# Altium project z80uPC.PrjPCB
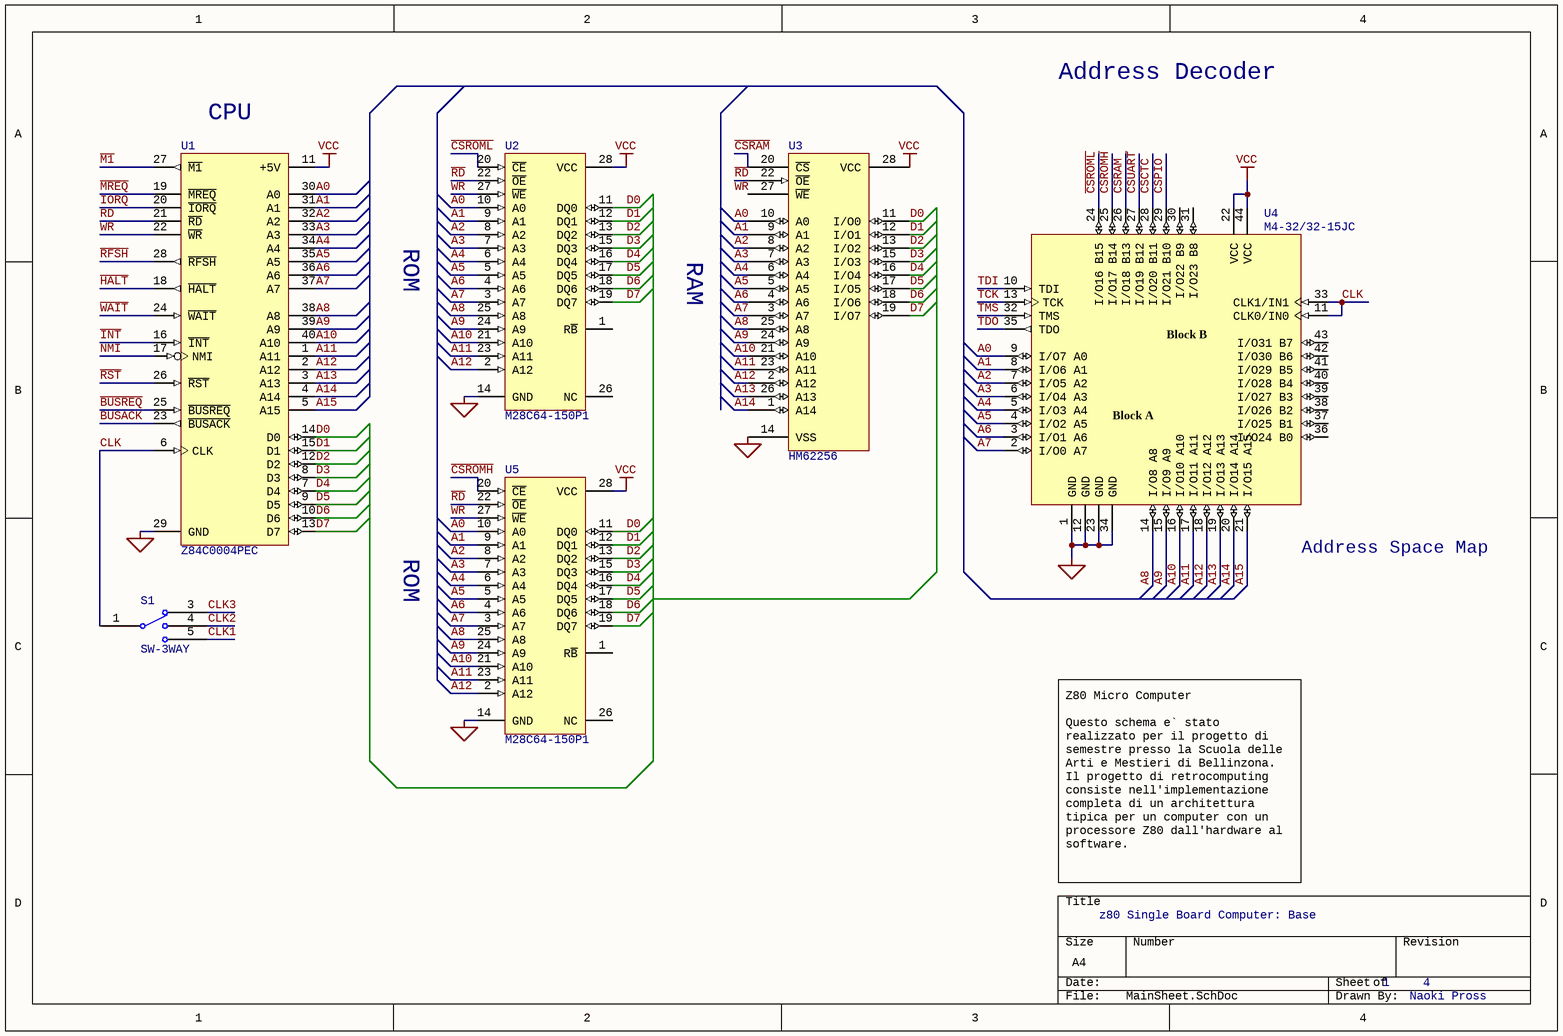
[diagram p0: MainSheet.SchDoc]
4 sheets, 72 parts. Net scope: global (net labels, ports and power ports of the same name join across sheets).
Sheets:
  MainSheet.SchDoc
  Peripherals.SchDoc
  IODevices.SchDoc
  BusViewer.SchDoc

## Sheet MainSheet.SchDoc: z80 Single Board Computer: Base
size A4; Author: Naoki Pross; DrawnBy: Naoki Pross; Organization: SAM Bellinzona; DocumentNumber: 1; Revision: 1; SheetNumber: 1; SheetTotal: 4; ProjectName: z80uPC

### Parts
S1  SW-3WAY
U1  Z84C0004PEC  [PDIP40]
U2  M28C64-150P1  [PDIP28]
U3  HM62256  [PDIP28]
U4  M4-32/32-15JC  [PLCC44_N]
U5  M28C64-150P1  [PDIP28]

### Nets
GND: U1.29(GND) U2.14(GND) U3.14(VSS) U4.1(GND) U4.12(GND) U4.23(GND) U4.34(GND) U5.14(GND)  [project net DB9-5]
VCC: U1.11(+5V) U2.28(VCC) U3.28(VCC) U4.22(VCC) U4.44(VCC) U5.28(VCC)
A0: U1.30(A0) U2.10(A0) U3.10(A0) U4.9(I/O7_A0) U5.10(A0)
A1: U1.31(A1) U2.9(A1) U3.9(A1) U4.8(I/O6_A1) U5.9(A1)
A2: U1.32(A2) U2.8(A2) U3.8(A2) U4.7(I/O5_A2) U5.8(A2)
A3: U1.33(A3) U2.7(A3) U3.7(A3) U4.6(I/O4_A3) U5.7(A3)
A4: U1.34(A4) U2.6(A4) U3.6(A4) U4.5(I/O3_A4) U5.6(A4)
A5: U1.35(A5) U2.5(A5) U3.5(A5) U4.4(I/O2_A5) U5.5(A5)
A6: U1.36(A6) U2.4(A6) U3.4(A6) U4.3(I/O1_A6) U5.4(A6)
A7: U1.37(A7) U2.3(A7) U3.3(A7) U4.2(I/O0_A7) U5.3(A7)
A8: U1.38(A8) U2.25(A8) U3.25(A8) U4.14(I/O8_A8) U5.25(A8)
A9: U1.39(A9) U2.24(A9) U3.24(A9) U4.15(I/O9_A9) U5.24(A9)
A10: U1.40(A10) U2.21(A10) U3.21(A10) U4.16(I/O10_A10) U5.21(A10)
A11: U1.1(A11) U2.23(A11) U3.23(A11) U4.17(I/O11_A11) U5.23(A11)
A12: U1.2(A12) U2.2(A12) U3.2(A12) U4.18(I/O12_A12) U5.2(A12)
A13: U1.3(A13) U3.26(A13) U4.19(I/O13_A13)
A14: U1.4(A14) U3.1(A14) U4.20(I/O14_A14)
A15: U1.5(A15) U4.21(I/O15_A15)
~{BUSACK}: U1.23(~{BUSACK})
~{BUSREQ}: U1.25(~{BUSREQ})
~{CSCTC}: U4.28(I/O20_B11)
~{CSPIO}: U4.29(I/O21_B10)
~{CSRAM}: U3.20(~{CS}) U4.26(I/O18_B13)
~{CSROMH}: U4.25(I/O17_B14) U5.20(~{CE})
~{CSROML}: U2.20(~{CE}) U4.24(I/O16_B15)
~{CSUART}: U4.27(I/O19_B12)
CLK: U1.6(CLK) U4.11(CLK0/IN0) U4.33(CLK1/IN1)
D0: U1.14(D0) U2.11(DQ0) U3.11(I/O0) U5.11(DQ0)
D1: U1.15(D1) U2.12(DQ1) U3.12(I/O1) U5.12(DQ1)
D2: U1.12(D2) U2.13(DQ2) U3.13(I/O2) U5.13(DQ2)
D3: U1.8(D3) U2.15(DQ3) U3.15(I/O3) U5.15(DQ3)
D4: U1.7(D4) U2.16(DQ4) U3.16(I/O4) U5.16(DQ4)
D5: U1.9(D5) U2.17(DQ5) U3.17(I/O5) U5.17(DQ5)
D6: U1.10(D6) U2.18(DQ6) U3.18(I/O6) U5.18(DQ6)
D7: U1.13(D7) U2.19(DQ7) U3.19(I/O7) U5.19(DQ7)
~{HALT}: U1.18(~{HALT})
~{INT}: U1.16(~{INT})
~{IORQ}: U1.20(~{IORQ})
~{M1}: U1.27(~{M1})
~{MREQ}: U1.19(~{MREQ})
NMI: U1.17(NMI)
~{RD}: U1.21(~{RD}) U2.22(~{OE}) U3.22(~{OE}) U5.22(~{OE})
~{RFSH}: U1.28(~{RFSH})
~{RST}: U1.26(~{RST})
TCK: U4.13(TCK)
TDI: U4.10(TDI)
TDO: U4.35(TDO)
TMS: U4.32(TMS)
~{WAIT}: U1.24(~{WAIT})
~{WR}: U1.22(~{WR}) U2.27(~{WE}) U5.27(~{WE})

Not connected (* = marked no-connect by the designer): S1 1 3 4 5; U2 1(R~{B}) 26(NC); U3 27(~{WE}); U4 30(I/O22_B9) 31(I/O23_B8) 36(I/O24_B0) 37(I/O25_B1) 38(I/O26_B2) 39(I/O27_B3) 40(I/O28_B4) 41(I/O29_B5) 42(I/O30_B6) 43(I/O31_B7); U5 1(R~{B}) 26(NC)

### Notes on the sheet
- Address Decoder
- (near U1) CPU
- ROM
- RAM
- (near U4) Address Space Map
- Z80 Micro Computer
  Questo schema e` stato realizzato per il progetto di semestre presso la Scuola delle Arti e Mestieri di Bellinzona. Il progetto di retrocomputing consiste nell'implementazione completa di un architettura tipica per un computer con un processore Z80 dall'hardware al software.
- Labels drawn without touching a wire or pin: ~{WR}
- (in symbol M4-32/32-15JC) Block B; Block A

### Library data of the parts
S1 = SW-3WAY: SGA-13P-03V-7295
U1 = Z84C0004PEC: CMOS 8-Bit Microprocessor; Published: 15-Apr-2002; LatestRevisionDate: 04-Mar-2005; LatestRevisionNote: Stylized 3D Model Added.; DatasheetVersion: Jan-1989; PackageVersion: Jun-1999; PackageReference: PDIP40; Publisher: Altium Limited; PackageDescription: DIP; 40 Leads; Row Spacing 15.24 mm; Pitch 2.54 mm; ComponentLink1Description: Manufacturer Link; ComponentLink1URL: http://www.zilog.com/
U2 U5 = M28C64-150P1: Parallel 64 Kbit (8K x 8) EEPROM with Software Data Protection; Published: 24-Aug-2001; LatestRevisionDate: 06-Jun-2005; LatestRevisionNote: Stylized 3D Model Added.; DatasheetVersion: Jun-1996; PackageVersion: Jan-2003; PackageReference: PDIP28; Publisher: Altium Limited; PackageDescription: DIP; 28 Leads; Row Spacing 15.24 mm; Pitch 2.54 mm; ComponentLink1Description: Manufacturer Link; ComponentLink1URL: http://www.st.com/
U3 = HM62256: 8K x 8 Static RAM
U4 = M4-32/32-15JC: High-Performance EE CMOS In-System Programmable Logic; Published: 23-Sep-2002; LatestRevisionDate: 13-Apr-2006; LatestRevisionNote: IPC-7351 Footprint Added.; DatasheetVersion: Mar-2000; PackageVersion: pkg_32, Aug-2005; PackageReference: PLCC44; Publisher: Altium Limited; PackageDescription: 44-Pin Leaded Chip Carrier 1.27 mm Pitch; Code_IPC: PLCC-44; ComponentLink1Description: Manufacturer Link; ComponentLink1URL: http://www.latticesemi.com/products/mature/index.cfm; ComponentLink2Description: Datasheet; ComponentLink2URL: http://www.latticesemi.com/lit/docs/datasheets/cpld/mach4.pdf

## Sheet Peripherals.SchDoc: z80 Single Board Computer: Peripherals
size A4; DrawnBy: Naoki Pross; SheetNumber: 2; SheetTotal: 4
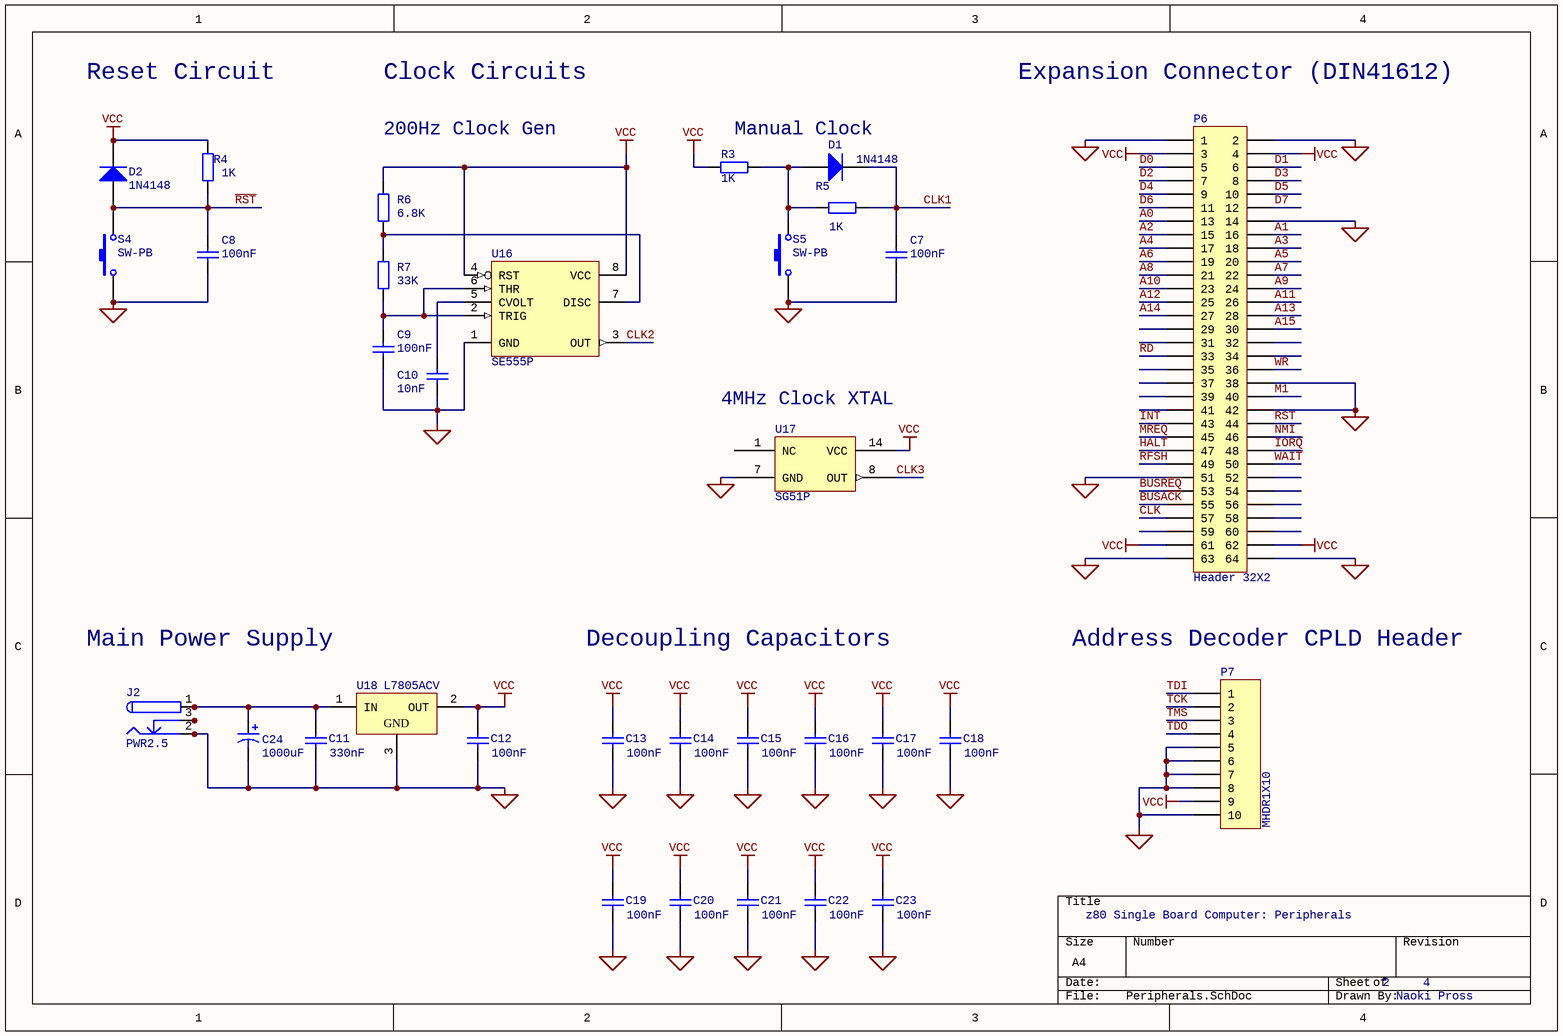
[diagram p1: Peripherals.SchDoc]

### Parts
C7  value 100nF  [RAD-0.1]  (hidden comment: Cap)
C8  value 100nF  [RAD-0.1]  (hidden comment: Cap)
C9  value 100nF  [RAD-0.1]  (hidden comment: Cap)
C10  value 10nF  [RAD-0.4]  (hidden comment: Cap)
C11  value 330nF  [RAD-0.3]  (hidden comment: Cap)
C12  value 100nF  [RAD-0.1]  (hidden comment: Cap)
C13  value 100nF  [RAD-0.1]  (hidden comment: Cap)
C14  value 100nF  [RAD-0.1]  (hidden comment: Cap)
C15  value 100nF  [RAD-0.1]  (hidden comment: Cap)
C16  value 100nF  [RAD-0.1]  (hidden comment: Cap)
C17  value 100nF  [RAD-0.1]  (hidden comment: Cap)
C18  value 100nF  [RAD-0.1]  (hidden comment: Cap)
C19  value 100nF  [RAD-0.1]  (hidden comment: Cap)
C20  value 100nF  [RAD-0.1]  (hidden comment: Cap)
C21  value 100nF  [RAD-0.1]  (hidden comment: Cap)
C22  value 100nF  [RAD-0.1]  (hidden comment: Cap)
C23  value 100nF  [RAD-0.1]  (hidden comment: Cap)
C24  value 1000uF  [RB5-10.5]  (hidden comment: Cap Pol1)
D1  1N4148  [DO-35]
D2  1N4148  [DO-35]
J2  PWR2.5  [KLD-0202]
P6  Header 32X2  [0973264X804]
P7  MHDR1X10  [HDR5x2_SOCK]
R3  value 1K  [AXIAL-0.4]  (hidden comment: Res2)
R4  value 1K  [AXIAL-0.4]  (hidden comment: Res2)
R5  value 1K  [AXIAL-0.4]  (hidden comment: Res2)
R6  value 6.8K  [AXIAL-0.4]  (hidden comment: Res2)
R7  value 33K  [AXIAL-0.4]  (hidden comment: Res2)
S4  SW-PB  [DPST-4]
S5  SW-PB  [DPST-4]
U16  SE555P  [P008]
U17  SG51P  [DIP14]
U18  L7805ACV  [TO220ABN]

### Nets
GND: C7.1 C8.1 C9.1 C10.1 C11.1 C12.1 C13.1 C14.1 C15.1 C16.1 C17.1 C18.1 C19.1 C20.1 C21.1 C22.1 C23.1 C24.2 J2.2 J2.2A J2.2B P6.1 P6.2 P6.14 P6.38 P6.42 P6.51 P6.63 P6.64 P7.5 P7.6 P7.7 P7.8 P7.10 S4.1 S5.1 U16.1(GND) U17.7(GND) U18.3(GND)  [project net DB9-5]
VCC: C12.2 C13.2 C14.2 C15.2 C16.2 C17.2 C18.2 C19.2 C20.2 C21.2 C22.2 C23.2 D2.2(K) P6.3 P6.4 P6.61 P6.62 P7.9 R3.2 R4.2 R6.2 U16.4(RST) U16.8(VCC) U17.14(VCC) U18.2(OUT)
A0: P6.13
A1: P6.16
A2: P6.15
A3: P6.18
A4: P6.17
A5: P6.20
A6: P6.19
A7: P6.22
A8: P6.21
A9: P6.24
A10: P6.23
A11: P6.26
A12: P6.25
A13: P6.28
A14: P6.27
A15: P6.30
~{BUSACK}: P6.55
~{BUSREQ}: P6.53
CLK: P6.57
CLK1: C7.2 D1.2(K) R5.2
CLK2: U16.3(OUT)
CLK3: U17.8(OUT)
D0: P6.5
D1: P6.6
D2: P6.7
D3: P6.8
D4: P6.9
D5: P6.10
D6: P6.11
D7: P6.12
~{HALT}: P6.47
~{INT}: P6.43
~{IORQ}: P6.48
~{M1}: P6.40
~{MREQ}: P6.45
NMI: P6.46
~{RD}: P6.33
~{RFSH}: P6.49
~{RST}: C8.2 D2.1(A) P6.44 R4.1 S4.2
TCK: P7.2
TDI: P7.1
TDO: P7.4
TMS: P7.3
~{WAIT}: P6.50
~{WR}: P6.36
NetC9_2: C9.2 R7.1 U16.2(TRIG) U16.6(THR)
NetC10_2: C10.2 U16.5(CVOLT)
NetC11_2: C11.2 C24.1 J2.1 J2.1A J2.1B U18.1(IN)
NetD1_1: D1.1(A) R3.1 R5.1 S5.2
NetJ2_3: J2.3 J2.3A J2.3B
NetR6_1: R6.1 R7.2 U16.7(DISC)

Not connected (* = marked no-connect by the designer): P6 29 31 32 34 35 37 39 41 52 54 56 58 59 60; U17 1(NC)

### Notes on the sheet
- Reset Circuit
- Clock Circuits
- Expansion Connector (DIN41612)
- 200Hz Clock Gen
- Manual Clock
- (near U17) 4MHz Clock XTAL
- Main Power Supply
- Decoupling Capacitors
- (near P7) Address Decoder CPLD Header

### Library data of the parts
C7-C23 = Cap: Capacitor; Published: 8-Jun-2000; LatestRevisionDate: 17-Jul-2002; LatestRevisionNote: Re-released for DXP Platform.; PackageReference: RAD-0.3; Publisher: Altium Limited; PackageDescription: Radial Cap, Thru-Hole; 2 Leads; 0.3 in Pin Spacing
C24 = Cap Pol1: Polarized Capacitor (Radial); Published: 8-Jun-2000; LatestRevisionDate: 17-Jul-2002; LatestRevisionNote: Re-released for DXP Platform.; PackageReference: RB7.6-15; Publisher: Altium Limited; PackageDescription: Polarized Capacitor (Radial); 2 Leads
D1 D2 = Diode 1N4148: High Conductance Fast Diode; Published: 8-Jun-2000; LatestRevisionDate: 17-Jul-2002; LatestRevisionNote: Re-released for DXP Platform.; DatasheetVersion: 1997; PackageReference: DO-35; Publisher: Altium Limited; PackageDescription: Diode, Axial; Body 3.8 x 1.9 mm (LxDia. max), Lead Dia. 0.53 mm (max); Code_JEDEC: DO-204-AH; ComponentLink1Description: Manufacturer Link; ComponentLink1URL: http://www.fairchildsemi.com/; ComponentLink2Description: Datasheet; ComponentLink2URL: http://www.fairchildsemi.com/ds/1N%2F1N4148.pdf
J2 = PWR2.5: Low Voltage Power Supply Connector; pin to pad: 1A>1 1B>1 2A>2 2B>2 3A>3 3B>3; Published: 17-Dec-2003; DatasheetDocument: 09-May-2002; Publisher: Altium Limited; ComponentLink1Description: Manufacturer Link; ComponentLink1URL: http://domino.kycon.com/internet/Products.html
P6 = Header 32X2: Header, 32-Pin, Dual row; pin to pad: 1>C1 2>A1 3>C2 4>A2 5>C3 6>A3 7>C4 8>A4 9>C5 10>A5 11>C6 12>A6 13>C7 14>A7 15>C8 16>A8 17>C9 18>A9 19>C10 20>A10 21>C11 22>A11 23>C12 24>A12 25>C13 26>A13 27>C14 28>A14 29>C15 30>A15 31>C16 32>A16 33>C17 34>A17 35>C18 36>A18 37>C19 38>A19 39>C20 40>A20 41>C21 42>A21 43>C22 44>A22 45>C23 46>A23 47>C24 48>A24 49>C25 50>A25 51>C26 52>A26 53>C27 54>A27 55>C28 56>A28 57>C29 58>A29 59>C30 60>A30 61>C31 62>A31 63>C32 64>A32; LatestRevisionDate: 17-Jul-2002; LatestRevisionNote: Re-released for DXP Platform.; Publisher: Altium Limited
P7 = MHDR1X10: Header, 10-Pin; LatestRevisionDate: 17-Jul-2002; LatestRevisionNote: Re-released for DXP Platform.; Publisher: Altium Limited
R3-R7 = Res2: Resistor; Published: 8-Jun-2000; LatestRevisionDate: 17-Jul-2002; LatestRevisionNote: Re-released for DXP Platform.; PackageReference: AXIAL-0.4; Publisher: Altium Limited; PackageDescription: Axial Device, Thru-Hole; 2 Leads; 0.4 in Pin Spacing
S4 S5 = SW-PB: Switch; Published: 24-Mar-1999; LatestRevisionDate: 17-Jul-2002; LatestRevisionNote: Re-released for DXP Platform.; PackageReference: SPST-2; Publisher: Altium Limited; PackageDescription: Switch; 2 Leads
U16 = SE555P: Precision Timer; Published: 16-Jan-2001; LatestRevisionDate: 04-Mar-2005; LatestRevisionNote: Stylized 3D Model Added.; DatasheetVersion: Feb-1992; PackageVersion: Jun-1999; PackageReference: P008; Publisher: Altium Limited; PackageDescription: DIP; 8 Leads; Row Spacing 7.62 mm; Pitch 2.54 mm; Code_JEDEC: MO-001-AN; ComponentLink1Description: Manufacturer Link; ComponentLink1URL: http://www.ti.com/; ComponentLink2Description: Datasheet; ComponentLink2URL: http://www-s.ti.com/sc/ds/se555.pdf
U17 = SG51P: 4.000000  MHz High Frequency Oscillator
U18 = L7805ACV: Precision 1A Regulator; Note: Tab is connected to pin 3 (GND).; Published: 24-Aug-2001; LatestRevisionDate: 17-Jul-2002; LatestRevisionNote: Re-released for DXP Platform.; DatasheetVersion: Nov-1999; PackageVersion: Jun-1998; PackageReference: TO220ABN; Publisher: Altium Limited; PackageDescription: TO, Thru-Hole, Vertical, Heatsink Mounted; 3 In-Line Leads; Pitch 2.54 mm; Pin sequence 1, 3, 2; ComponentLink1Description: Manufacturer Link; ComponentLink1URL: http://www.st.com/; ComponentLink2Description: Datasheet; ComponentLink2URL: http://www.st.com/stonline/products/literature/ds/2144/l7805ab.pdf

## Sheet IODevices.SchDoc: z80 Single Board Computer: I/O Devices
size A4; Author: Naoki Pross; DrawnBy: Naoki Pross; DocumentNumber: 3; SheetNumber: 2; SheetTotal: 4
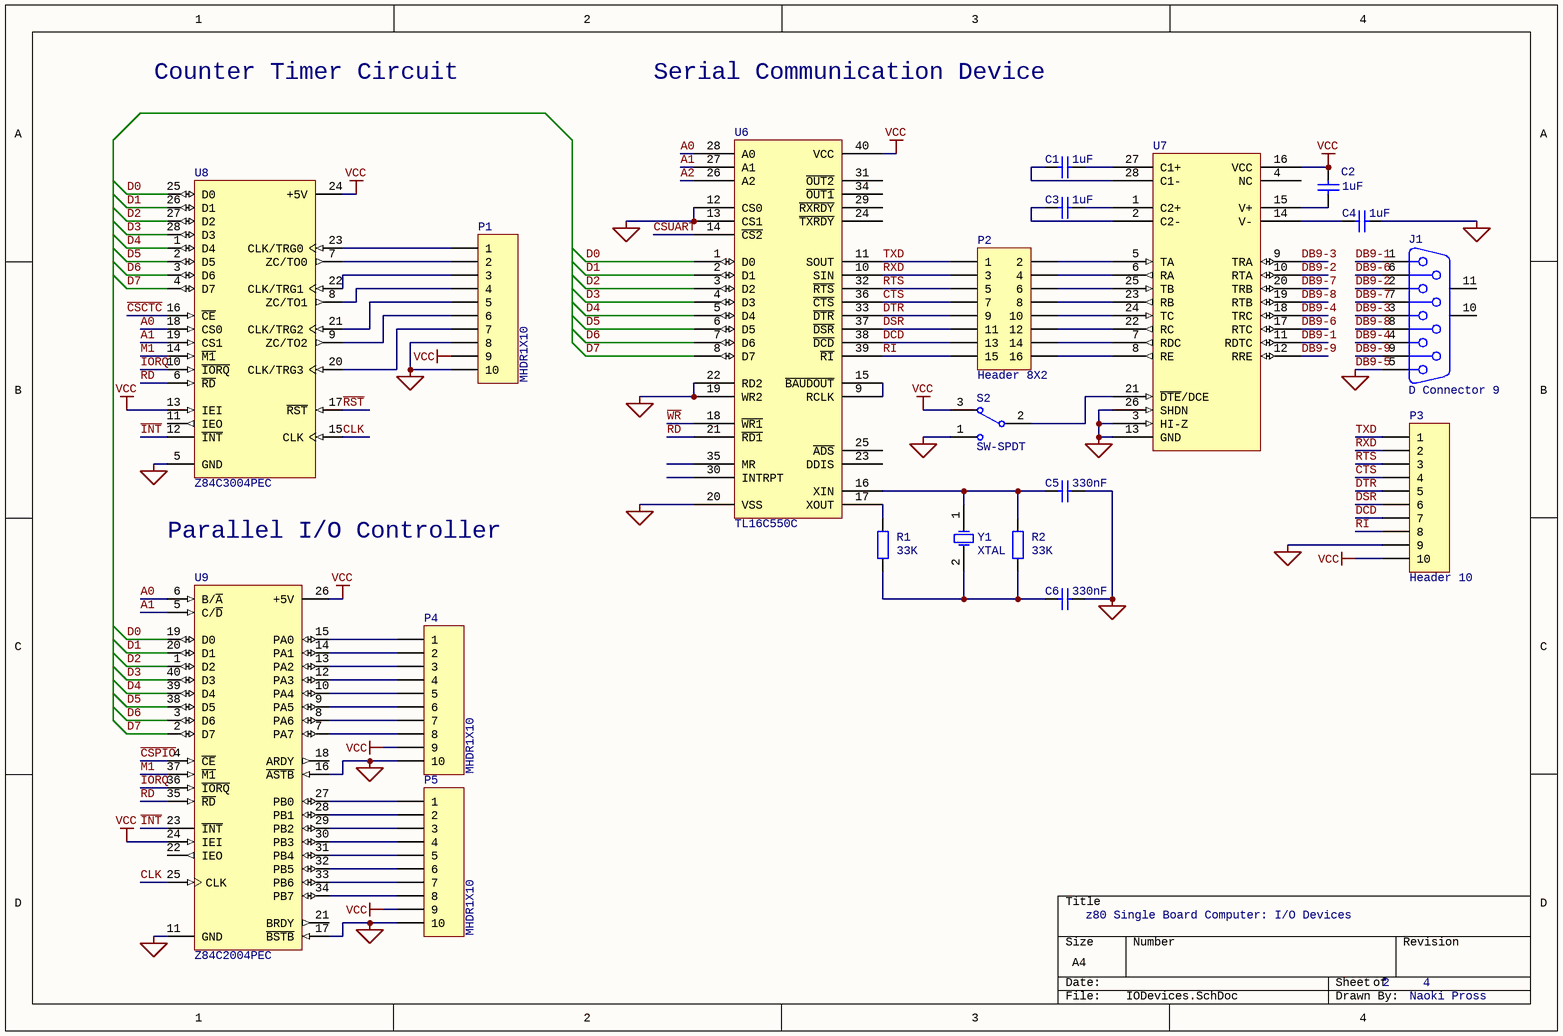
[diagram p2: IODevices.SchDoc]

### Parts
C1  value 1uF  [RAD-0.3]  (hidden comment: Cap)
C2  value 1uF  [RAD-0.3]  (hidden comment: Cap)
C3  value 1uF  [RAD-0.3]  (hidden comment: Cap)
C4  value 1uF  [RAD-0.3]  (hidden comment: Cap)
C5  value 330nF  [RAD-0.3]  (hidden comment: Cap)
C6  value 330nF  [RAD-0.3]  (hidden comment: Cap)
J1  D Connector 9  [DSUB1.385-2H9]
P1  MHDR1X10  [MHDR2X5]
P2  Header 8X2  [HDR2X8]
P3  Header 10  [MHDR2X5]
P4  MHDR1X10  [MHDR2X5]
P5  MHDR1X10  [MHDR2X5]
R1  value 33K  [AXIAL-0.4]  (hidden comment: Res2)
R2  value 33K  [AXIAL-0.4]  (hidden comment: Res2)
S2  SW-SPDT  [TL36WW15050]
U6  TL16C550C
U7  MAX214  (value not drawn)
U8  Z84C3004PEC  [PDIP28]
U9  Z84C2004PEC  [PDIP40]
Y1  XTAL  [R38]

### Nets
DB9-5: C4.2 C5.2 C6.2 J1.5 P1.8 P1.10 P3.9 P4.10 P5.10 S2.1 U6.12(CS0) U6.13(CS1) U6.19(WR2) U6.20(VSS) U6.22(RD2) U7.3(HI-Z) U7.13(GND) U7.26(SHDN) U8.5(GND) U9.11(GND) U9.16(~{ASTB}) U9.17(~{BSTB})  [also labelled GND]
VCC: C2.2 P1.9 P3.10 P4.9 P5.9 S2.3 U6.40(VCC) U7.16(VCC) U8.13(IEI) U8.24(+5V) U9.24(IEI) U9.26(+5V)
A0: U6.28(A0) U8.18(CS0) U9.6(B/~{A})
A1: U6.27(A1) U8.19(CS1) U9.5(C/~{D})
A2: U6.26(A2)
~{CSCTC}: U8.16(~{CE})
~{CSPIO}: U9.4(~{CE})
~{CSUART}: U6.14(~{CS2})
~{CTS}: P2.7 P3.4 U6.36(~{CTS})
CLK: U8.15(CLK) U9.25(CLK)
D0: U6.1(D0) U8.25(D0) U9.19(D0)
D1: U6.2(D1) U8.26(D1) U9.20(D1)
D2: U6.3(D2) U8.27(D2) U9.1(D2)
D3: U6.4(D3) U8.28(D3) U9.40(D3)
D4: U6.5(D4) U8.1(D4) U9.39(D4)
D5: U6.6(D5) U8.2(D5) U9.38(D5)
D6: U6.7(D6) U8.3(D6) U9.3(D6)
D7: U6.8(D7) U8.4(D7) U9.2(D7)
~{DCD}: P2.13 P3.7 U6.38(~{DCD})
~{DSR}: P2.11 P3.6 U6.37(~{DSR})
~{DTR}: P2.9 P3.5 U6.33(~{DTR})
DB9-1: J1.1 U7.11(RDTC)
DB9-2: J1.2 U7.10(RTA)
DB9-3: J1.3 U7.9(TRA)
DB9-4: J1.4 U7.18(TRC)
DB9-6: J1.6 U7.17(RTC)
DB9-7: J1.7 U7.20(TRB)
DB9-8: J1.8 U7.19(RTB)
DB9-9: J1.9 U7.12(RRE)
~{INT}: U8.12(~{INT}) U9.23(~{INT})
~{IORQ}: U8.10(~{IORQ}) U9.36(~{IORQ})
~{M1}: U8.14(~{M1}) U9.37(~{M1})
~{RD}: U6.21(~{RD1}) U8.6(~{RD}) U9.35(~{RD})
~{RI}: P2.15 P3.8 U6.39(~{RI})
~{RST}: U8.17(~{RST})
~{RTS}: P2.5 P3.3 U6.32(~{RTS})
RXD: P2.3 P3.2 U6.10(SIN)
TXD: P2.1 P3.1 U6.11(SOUT)
~{WR}: U6.18(~{WR1})
NetC1_1: C1.1 U7.28(C1-)
NetC1_2: C1.2 U7.27(C1+)
NetC2_1: C2.1 U7.15(V+)
NetC3_1: C3.1 U7.2(C2-)
NetC3_2: C3.2 U7.1(C2+)
NetC4_1: C4.1 U7.14(V-)
NetC5_1: C5.1 R2.2 U6.16(XIN) Y1.1(OSC1)
NetC6_1: C6.1 R1.1 R2.1 Y1.2(OSC2)
NetP1_1: P1.1 U8.23(CLK/TRG0)
NetP1_2: P1.2 U8.7(ZC/TO0)
NetP1_3: P1.3 U8.22(CLK/TRG1)
NetP1_4: P1.4 U8.8(ZC/TO1)
NetP1_5: P1.5 U8.21(CLK/TRG2)
NetP1_6: P1.6 U8.9(ZC/TO2)
NetP1_7: P1.7 U8.20(CLK/TRG3)
NetP2_2: P2.2 U7.5(TA)
NetP2_4: P2.4 U7.6(RA)
NetP2_6: P2.6 U7.25(TB)
NetP2_8: P2.8 U7.23(RB)
NetP2_10: P2.10 U7.24(TC)
NetP2_12: P2.12 U7.22(RC)
NetP2_14: P2.14 U7.7(RDC)
NetP2_16: P2.16 U7.8(RE)
NetP4_1: P4.1 U9.15(PA0)
NetP4_2: P4.2 U9.14(PA1)
NetP4_3: P4.3 U9.13(PA2)
NetP4_4: P4.4 U9.12(PA3)
NetP4_5: P4.5 U9.10(PA4)
NetP4_6: P4.6 U9.9(PA5)
NetP4_7: P4.7 U9.8(PA6)
NetP4_8: P4.8 U9.7(PA7)
NetP5_1: P5.1 U9.27(PB0)
NetP5_2: P5.2 U9.28(PB1)
NetP5_3: P5.3 U9.29(PB2)
NetP5_4: P5.4 U9.30(PB3)
NetP5_5: P5.5 U9.31(PB4)
NetP5_6: P5.6 U9.32(PB5)
NetP5_7: P5.7 U9.33(PB6)
NetP5_8: P5.8 U9.34(PB7)
NetR1_2: R1.2 U6.17(XOUT)
NetS2_2: S2.2 U7.21(~{DTE}/DCE)
NetU6_9: U6.9(RCLK) U6.15(~{BAUDOUT})

Not connected (* = marked no-connect by the designer): J1 10(MH1) 11(MH2); U6 23(DDIS) 24(~{TXRDY}) 25(~{ADS}) 29(~{RXRDY}) 30(INTRPT) 31(~{OUT2}) 34(~{OUT1}) 35(MR); U7 4(NC); U8 11(IEO); U9 18(ARDY) 21(BRDY) 22(IEO)

### Notes on the sheet
- Counter Timer Circuit
- Serial Communication Device
- Parallel I/O Controller

### Library data of the parts
C1-C6 = Cap: Capacitor; Published: 8-Jun-2000; LatestRevisionDate: 17-Jul-2002; LatestRevisionNote: Re-released for DXP Platform.; PackageReference: RAD-0.3; Publisher: Altium Limited; PackageDescription: Radial Cap, Thru-Hole; 2 Leads; 0.3 in Pin Spacing
J1 = D Connector 9: Receptacle Assembly, 9 Position, Right Angle; PackageDocument: O; Positions: 9; Published: 15-Jun-2001; LatestRevisionDate: 17-Jul-2002; LatestRevisionNote: Re-released for DXP Platform.; DatasheetDocument: 1-Sep-1999; PackageReference: 788750; Publisher: Altium Limited; Orientation: Right Angle; Gender: Receptacle
P1 P4 P5 = MHDR1X10: Header, 10-Pin; LatestRevisionDate: 17-Jul-2002; LatestRevisionNote: Re-released for DXP Platform.; Publisher: Altium Limited
P2 = Header 8X2: Header, 8-Pin, Dual row; LatestRevisionDate: 17-Jul-2002; LatestRevisionNote: Re-released for DXP Platform.; Publisher: Altium Limited
P3 = Header 10: Header, 10-Pin; LatestRevisionDate: 17-Jul-2002; LatestRevisionNote: Re-released for DXP Platform.; Publisher: Altium Limited
R1 R2 = Res2: Resistor; Published: 8-Jun-2000; LatestRevisionDate: 17-Jul-2002; LatestRevisionNote: Re-released for DXP Platform.; PackageReference: AXIAL-0.4; Publisher: Altium Limited; PackageDescription: Axial Device, Thru-Hole; 2 Leads; 0.4 in Pin Spacing
S2 = SW-SPDT: SPDT Subminiature Toggle Switch, Right Angle Mounting, Vertical Actuation; Published: 24-Mar-1999; LatestRevisionDate: 17-Dec-2003; LatestRevisionNote: Schematic revised, PCB Footprint replaced.; DatasheetVersion: 05-Dec-2000; PackageReference: TL36WW15050; Publisher: Altium Limited; PackageDescription: Switch; 4 Leads; ComponentLink1Description: Manufacturer Link; ComponentLink1URL: http://www.apem.com
U8 = Z84C3004PEC: CMOS Four-Channel Counter/Timer Circuit; Note: Pin(s) 28 "No Connection" and not drawn.; Published: 15-Apr-2002; LatestRevisionDate: 04-Mar-2005; LatestRevisionNote: Stylized 3D Model Added.; DatasheetVersion: 2001; PackageVersion: 2001; PackageReference: PDIP28; Publisher: Altium Limited; PackageDescription: DIP; 28 Leads; Row Spacing 15.24 mm; Pitch 2.54 mm; ComponentLink1Description: Manufacturer Link; ComponentLink1URL: http://www.zilog.com/; ComponentLink2Description: Datasheet; ComponentLink2URL: http://www.zilog.com/docs/z80/um0081.pdf
U9 = Z84C2004PEC: CMOS Parallel I/O Controller; Published: 15-Apr-2002; LatestRevisionDate: 04-Mar-2005; LatestRevisionNote: Stylized 3D Model Added.; DatasheetVersion: 2001; PackageVersion: Jun-1999; PackageReference: PDIP40; Publisher: Altium Limited; PackageDescription: DIP; 40 Leads; Row Spacing 15.24 mm; Pitch 2.54 mm; ComponentLink1Description: Manufacturer Link; ComponentLink1URL: http://www.zilog.com/; ComponentLink2Description: Datasheet; ComponentLink2URL: http://www.zilog.com/docs/z80/um0081.pdf
Y1 = XTAL: Crystal Oscillator; Published: 8-Jun-2000; LatestRevisionDate: 17-Jul-2002; LatestRevisionNote: Re-released for DXP Platform.; PackageReference: R38; Publisher: Altium Limited; PackageDescription: Crystal, Thru-Hole; 2 Leads; Body 3.1 x 8.2 mm (Dia.xH)

## Sheet BusViewer.SchDoc: z80 Single Board Computer: Bus Data Visualizer
size A4; DrawnBy: Naoki Pross; DocumentNumber: 4; SheetNumber: 4; SheetTotal: 4
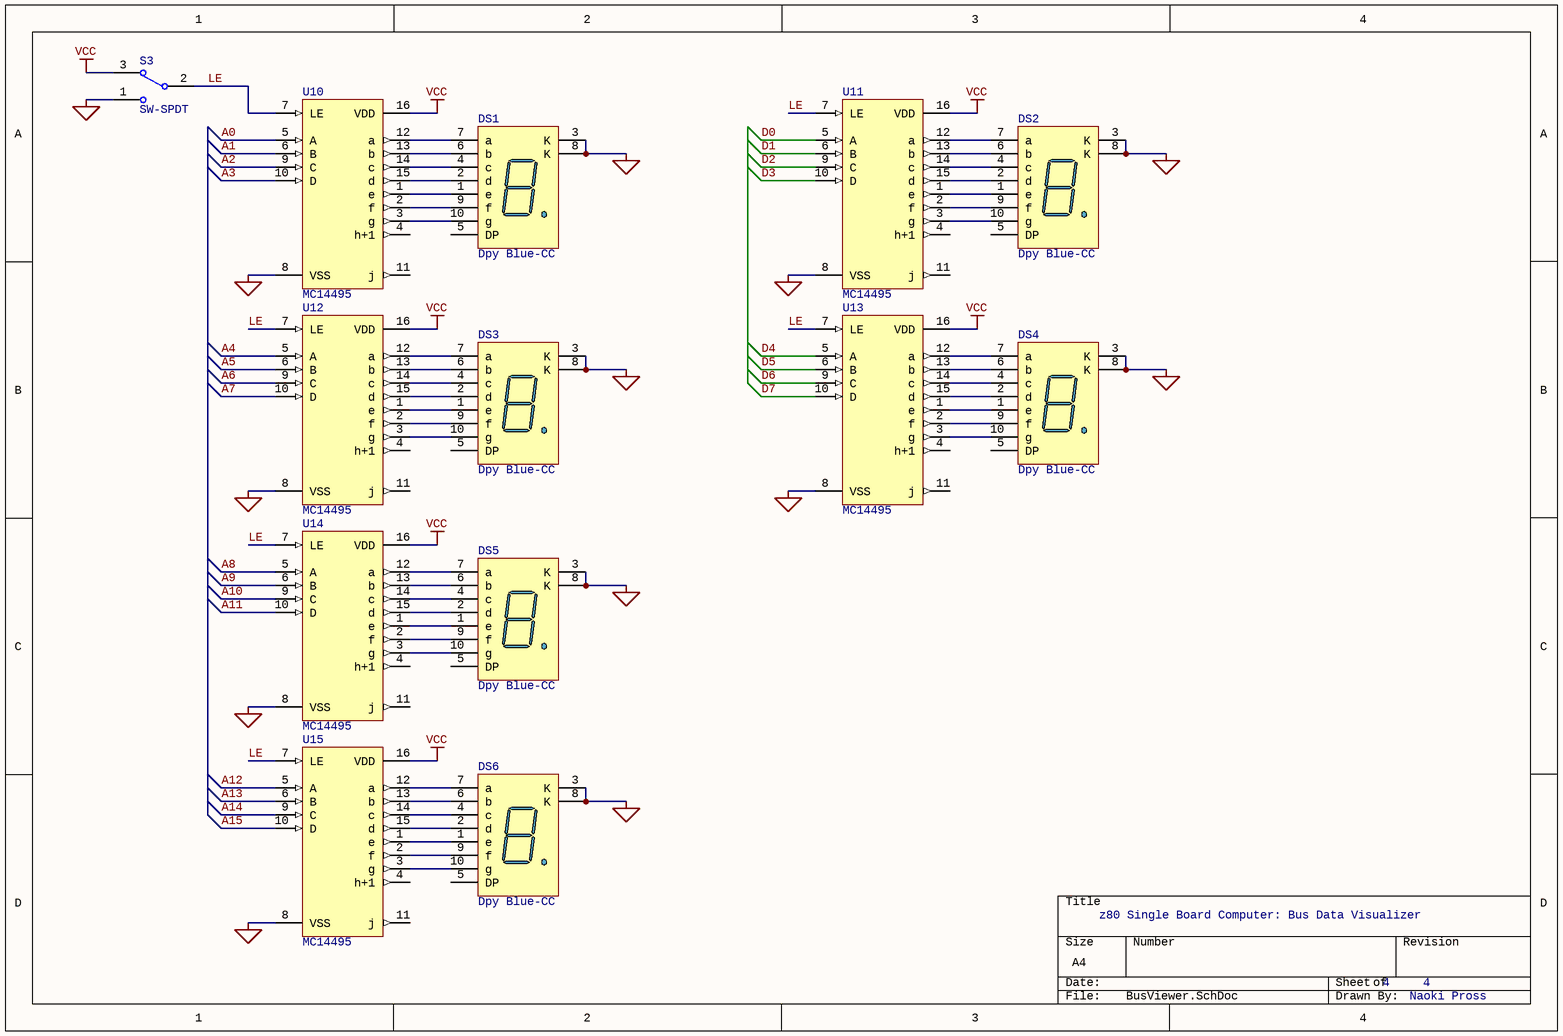
[diagram p3: BusViewer.SchDoc]

### Parts
DS1  Dpy Blue-CC  [H]
DS2  Dpy Blue-CC  [H]
DS3  Dpy Blue-CC  [H]
DS4  Dpy Blue-CC  [H]
DS5  Dpy Blue-CC  [H]
DS6  Dpy Blue-CC  [H]
S3  SW-SPDT  [SW_2WAY]
U10  MC14495  [DIP16]
U11  MC14495  [DIP16]
U12  MC14495  [DIP16]
U13  MC14495  [DIP16]
U14  MC14495  [DIP16]
U15  MC14495  [DIP16]

### Nets
GND: DS1.3(K) DS1.8(K) DS2.3(K) DS2.8(K) DS3.3(K) DS3.8(K) DS4.3(K) DS4.8(K) DS5.3(K) DS5.8(K) DS6.3(K) DS6.8(K) S3.1 U10.8(VSS) U11.8(VSS) U12.8(VSS) U13.8(VSS) U14.8(VSS) U15.8(VSS)  [project net DB9-5]
VCC: S3.3 U10.16(VDD) U11.16(VDD) U12.16(VDD) U13.16(VDD) U14.16(VDD) U15.16(VDD)
A0: U10.5(A)
A1: U10.6(B)
A2: U10.9(C)
A3: U10.10(D)
A4: U12.5(A)
A5: U12.6(B)
A6: U12.9(C)
A7: U12.10(D)
A8: U14.5(A)
A9: U14.6(B)
A10: U14.9(C)
A11: U14.10(D)
A12: U15.5(A)
A13: U15.6(B)
A14: U15.9(C)
A15: U15.10(D)
D0: U11.5(A)
D1: U11.6(B)
D2: U11.9(C)
D3: U11.10(D)
D4: U13.5(A)
D5: U13.6(B)
D6: U13.9(C)
D7: U13.10(D)
LE: S3.2 U10.7(LE) U11.7(LE) U12.7(LE) U13.7(LE) U14.7(LE) U15.7(LE)
NetDS1_1: DS1.1(e) U10.1(e)
NetDS1_2: DS1.2(d) U10.15(d)
NetDS1_4: DS1.4(c) U10.14(c)
NetDS1_6: DS1.6(b) U10.13(b)
NetDS1_7: DS1.7(a) U10.12(a)
NetDS1_9: DS1.9(f) U10.2(f)
NetDS1_10: DS1.10(g) U10.3(g)
NetDS2_1: DS2.1(e) U11.1(e)
NetDS2_2: DS2.2(d) U11.15(d)
NetDS2_4: DS2.4(c) U11.14(c)
NetDS2_6: DS2.6(b) U11.13(b)
NetDS2_7: DS2.7(a) U11.12(a)
NetDS2_9: DS2.9(f) U11.2(f)
NetDS2_10: DS2.10(g) U11.3(g)
NetDS3_1: DS3.1(e) U12.1(e)
NetDS3_2: DS3.2(d) U12.15(d)
NetDS3_4: DS3.4(c) U12.14(c)
NetDS3_6: DS3.6(b) U12.13(b)
NetDS3_7: DS3.7(a) U12.12(a)
NetDS3_9: DS3.9(f) U12.2(f)
NetDS3_10: DS3.10(g) U12.3(g)
NetDS4_1: DS4.1(e) U13.1(e)
NetDS4_2: DS4.2(d) U13.15(d)
NetDS4_4: DS4.4(c) U13.14(c)
NetDS4_6: DS4.6(b) U13.13(b)
NetDS4_7: DS4.7(a) U13.12(a)
NetDS4_9: DS4.9(f) U13.2(f)
NetDS4_10: DS4.10(g) U13.3(g)
NetDS5_1: DS5.1(e) U14.1(e)
NetDS5_2: DS5.2(d) U14.15(d)
NetDS5_4: DS5.4(c) U14.14(c)
NetDS5_6: DS5.6(b) U14.13(b)
NetDS5_7: DS5.7(a) U14.12(a)
NetDS5_9: DS5.9(f) U14.2(f)
NetDS5_10: DS5.10(g) U14.3(g)
NetDS6_1: DS6.1(e) U15.1(e)
NetDS6_2: DS6.2(d) U15.15(d)
NetDS6_4: DS6.4(c) U15.14(c)
NetDS6_6: DS6.6(b) U15.13(b)
NetDS6_7: DS6.7(a) U15.12(a)
NetDS6_9: DS6.9(f) U15.2(f)
NetDS6_10: DS6.10(g) U15.3(g)

Not connected (* = marked no-connect by the designer): DS1 5(DP); DS2 5(DP); DS3 5(DP); DS4 5(DP); DS5 5(DP); DS6 5(DP); U10 4(h+1) 11(j); U11 4(h+1) 11(j); U12 4(h+1) 11(j); U13 4(h+1) 11(j); U14 4(h+1) 11(j); U15 4(h+1) 11(j)

### Library data of the parts
DS1-DS6 = Dpy Blue-CC: 14.2 mm General Purpose Blue 7-Segment Display: CC, RH DP, Gray Surface; MinimumIntensity: 2020 ucd; Note: IF = 10 mA; Published: 8-Jun-2000; LatestRevisionDate: 17-Dec-2003; LatestRevisionNote: Schematic revised, PCB Footprint replaced.; DatasheetVersion: 24-Sep-2002; PackageVersion: 24-Sep-2002; PackageReference: H; Publisher: Altium Limited; PackageDescription: LED, 7-Segment Display, 14.2 mm, RHD; 10 Leads; Row Space 15.24 mm; Pitch 2.54 mm; Colour: Blue; ComponentLink1Description: Manufacturer Link; ComponentLink1URL: http://www.agilent.com/
S3 = SW-SPDT: as S2 on sheet IODevices; Published: 24-Mar-1999; LatestRevisionDate: 17-Dec-2003; LatestRevisionNote: Schematic revised, PCB Footprint replaced.; DatasheetVersion: 05-Dec-2000; PackageReference: TL36WW15050; Publisher: Altium Limited; PackageDescription: Switch; 4 Leads; ComponentLink1Description: Manufacturer Link; ComponentLink1URL: http://www.apem.com
U10-U15 = MC14495: Hexadecimal to seven segment Latch / Decoder LED Driver

## Nets that join several sheets
DB9-5: MainSheet (8 pins), Peripherals (39 pins), IODevices (22 pins), BusViewer (19 pins)
VCC: MainSheet (6 pins), Peripherals (25 pins), IODevices (12 pins), BusViewer (7 pins)
A0: MainSheet (5 pins), Peripherals (P6.13), IODevices (U6.28 U8.18 U9.6), BusViewer (U10.5)
A1: MainSheet (5 pins), Peripherals (P6.16), IODevices (U6.27 U8.19 U9.5), BusViewer (U10.6)
A2: MainSheet (5 pins), Peripherals (P6.15), IODevices (U6.26), BusViewer (U10.9)
A3: MainSheet (5 pins), Peripherals (P6.18), BusViewer (U10.10)
A4: MainSheet (5 pins), Peripherals (P6.17), BusViewer (U12.5)
A5: MainSheet (5 pins), Peripherals (P6.20), BusViewer (U12.6)
A6: MainSheet (5 pins), Peripherals (P6.19), BusViewer (U12.9)
A7: MainSheet (5 pins), Peripherals (P6.22), BusViewer (U12.10)
A8: MainSheet (5 pins), Peripherals (P6.21), BusViewer (U14.5)
A9: MainSheet (5 pins), Peripherals (P6.24), BusViewer (U14.6)
A10: MainSheet (5 pins), Peripherals (P6.23), BusViewer (U14.9)
A11: MainSheet (5 pins), Peripherals (P6.26), BusViewer (U14.10)
A12: MainSheet (5 pins), Peripherals (P6.25), BusViewer (U15.5)
A13: MainSheet (U1.3 U3.26 U4.19), Peripherals (P6.28), BusViewer (U15.6)
A14: MainSheet (U1.4 U3.1 U4.20), Peripherals (P6.27), BusViewer (U15.9)
A15: MainSheet (U1.5 U4.21), Peripherals (P6.30), BusViewer (U15.10)
~{BUSACK}: MainSheet (U1.23), Peripherals (P6.55)
~{BUSREQ}: MainSheet (U1.25), Peripherals (P6.53)
~{CSCTC}: MainSheet (U4.28), IODevices (U8.16)
~{CSPIO}: MainSheet (U4.29), IODevices (U9.4)
~{CSUART}: MainSheet (U4.27), IODevices (U6.14)
CLK: MainSheet (U1.6 U4.11 U4.33), Peripherals (P6.57), IODevices (U8.15 U9.25)
D0: MainSheet (U1.14 U2.11 U3.11 U5.11), Peripherals (P6.5), IODevices (U6.1 U8.25 U9.19), BusViewer (U11.5)
D1: MainSheet (U1.15 U2.12 U3.12 U5.12), Peripherals (P6.6), IODevices (U6.2 U8.26 U9.20), BusViewer (U11.6)
D2: MainSheet (U1.12 U2.13 U3.13 U5.13), Peripherals (P6.7), IODevices (U6.3 U8.27 U9.1), BusViewer (U11.9)
D3: MainSheet (U1.8 U2.15 U3.15 U5.15), Peripherals (P6.8), IODevices (U6.4 U8.28 U9.40), BusViewer (U11.10)
D4: MainSheet (U1.7 U2.16 U3.16 U5.16), Peripherals (P6.9), IODevices (U6.5 U8.1 U9.39), BusViewer (U13.5)
D5: MainSheet (U1.9 U2.17 U3.17 U5.17), Peripherals (P6.10), IODevices (U6.6 U8.2 U9.38), BusViewer (U13.6)
D6: MainSheet (U1.10 U2.18 U3.18 U5.18), Peripherals (P6.11), IODevices (U6.7 U8.3 U9.3), BusViewer (U13.9)
D7: MainSheet (U1.13 U2.19 U3.19 U5.19), Peripherals (P6.12), IODevices (U6.8 U8.4 U9.2), BusViewer (U13.10)
~{HALT}: MainSheet (U1.18), Peripherals (P6.47)
~{INT}: MainSheet (U1.16), Peripherals (P6.43), IODevices (U8.12 U9.23)
~{IORQ}: MainSheet (U1.20), Peripherals (P6.48), IODevices (U8.10 U9.36)
~{M1}: MainSheet (U1.27), Peripherals (P6.40), IODevices (U8.14 U9.37)
~{MREQ}: MainSheet (U1.19), Peripherals (P6.45)
NMI: MainSheet (U1.17), Peripherals (P6.46)
~{RD}: MainSheet (U1.21 U2.22 U3.22 U5.22), Peripherals (P6.33), IODevices (U6.21 U8.6 U9.35)
~{RFSH}: MainSheet (U1.28), Peripherals (P6.49)
~{RST}: MainSheet (U1.26), Peripherals (5 pins), IODevices (U8.17)
TCK: MainSheet (U4.13), Peripherals (P7.2)
TDI: MainSheet (U4.10), Peripherals (P7.1)
TDO: MainSheet (U4.35), Peripherals (P7.4)
TMS: MainSheet (U4.32), Peripherals (P7.3)
~{WAIT}: MainSheet (U1.24), Peripherals (P6.50)
~{WR}: MainSheet (U1.22 U2.27 U5.27), Peripherals (P6.36), IODevices (U6.18)